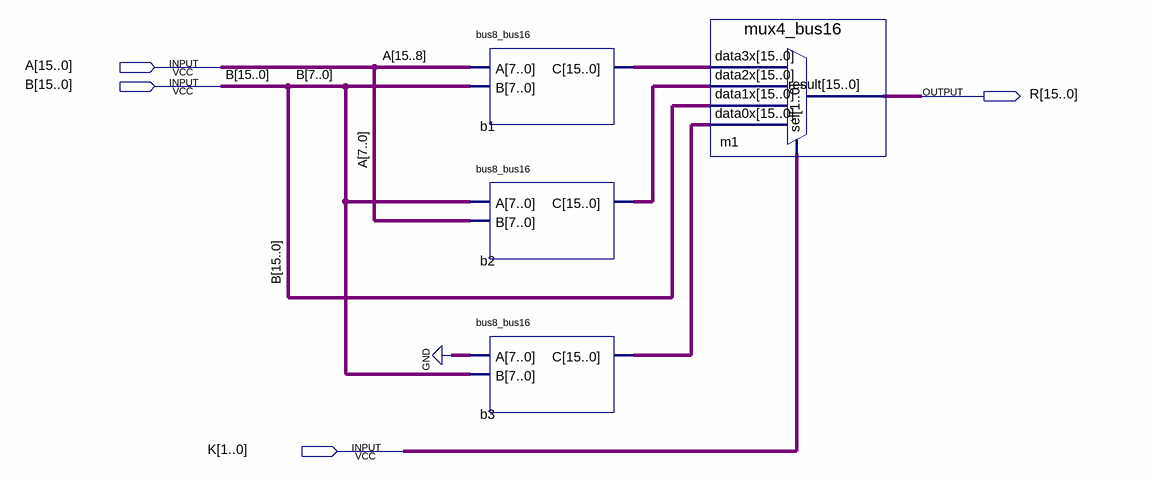
[diagram p0: schematic sheet]
// Quartus schematic extender.bdf as structural Verilog: 4 symbols, 4 pins
module extender (
  input  [15:0] A,
  input  [15:0] B,
  input  [1:0] K,
  output [15:0] R
);

  wire [15:0] b1_c, b2_c, b3_c;

  bus8_bus16 b1 (.A(A[15:8]), .B(B[7:0]), .C(b1_c));
  bus8_bus16 b2 (.A(B[7:0]), .B(A[7:0]), .C(b2_c));
  bus8_bus16 b3 (.A({8{1'b0}}), .B(B[7:0]), .C(b3_c));
  mux4_bus16 m1 (.data3x(b1_c), .data2x(b2_c), .data1x(B), .data0x(b3_c), .sel(K), .result(R));
endmodule
